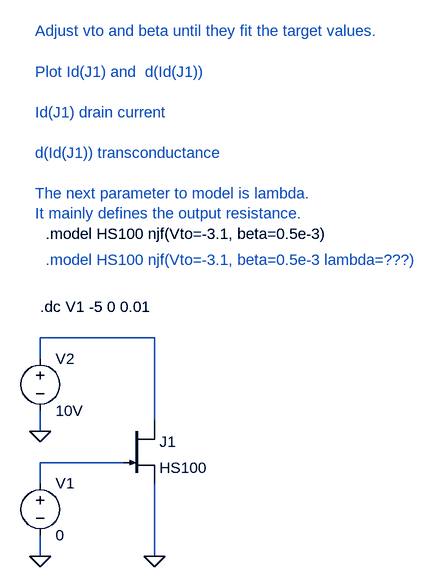
[diagram p0: schematic jfet_model.asc]
jfet_model.asc, the LTspice schematic file:
Version 4
SHEET 1 924 680
WIRE 176 272 176 384
WIRE 128 240 0 240
WIRE 0 240 0 272
WIRE 0 352 0 384
WIRE 176 176 176 48
WIRE 176 48 0 48
WIRE 0 48 0 80
WIRE 0 160 0 192
FLAG 0 384 0
FLAG 176 384 0
FLAG 0 192 0
SYMBOL njf 128 176 R0
SYMATTR InstName J1
SYMATTR Value HS100
SYMBOL voltage 0 256 R0
SYMATTR InstName V1
SYMATTR Value 0
SYMBOL voltage 0 64 R0
SYMATTR InstName V2
SYMATTR Value 10V
TEXT 0 0 Left 0 !.dc V1 -5 0 0.01
TEXT 8 -112 Left 0 !.model HS100 njf(Vto=-3.1, beta=0.5e-3)
TEXT -8 -424 Left 0 ;Adjust vto and beta until they fit the target values.\n \nPlot Id(J1) and  d(Id(J1))\n \nId(J1) drain current\n \nd(Id(J1)) transconductance\n \nThe next parameter to model is lambda. \nIt mainly defines the output resistance.
TEXT 8 -72 Left 0 ;.model HS100 njf(Vto=-3.1, beta=0.5e-3 lambda=???)

The netlist it stands for:
* jfet_model.asc
J1 N002 N001 0 HS100
V1 N001 0 0
V2 N002 0 10V
.model NJF NJF
.model PJF PJF
.lib standard.jft
.dc V1 -5 0 0.01
.model HS100 njf(Vto=-3.1, beta=0.5e-3)
* Adjust vto and beta until they fit the target values.
* Plot Id(J1) and  d(Id(J1))
* Id(J1) drain current
* d(Id(J1)) transconductance
* The next parameter to model is lambda.
* It mainly defines the output resistance.
* .model HS100 njf(Vto=-3.1, beta=0.5e-3 lambda=???)
.backanno
.end